# Altium schematic sheet Peripheral.SchDoc
size A4; Organization: Altium Limited; Address1: L3, 12a Rodborough Rd; Address2: Frenchs Forest; Address3: NSW; Address4: Australia 2086
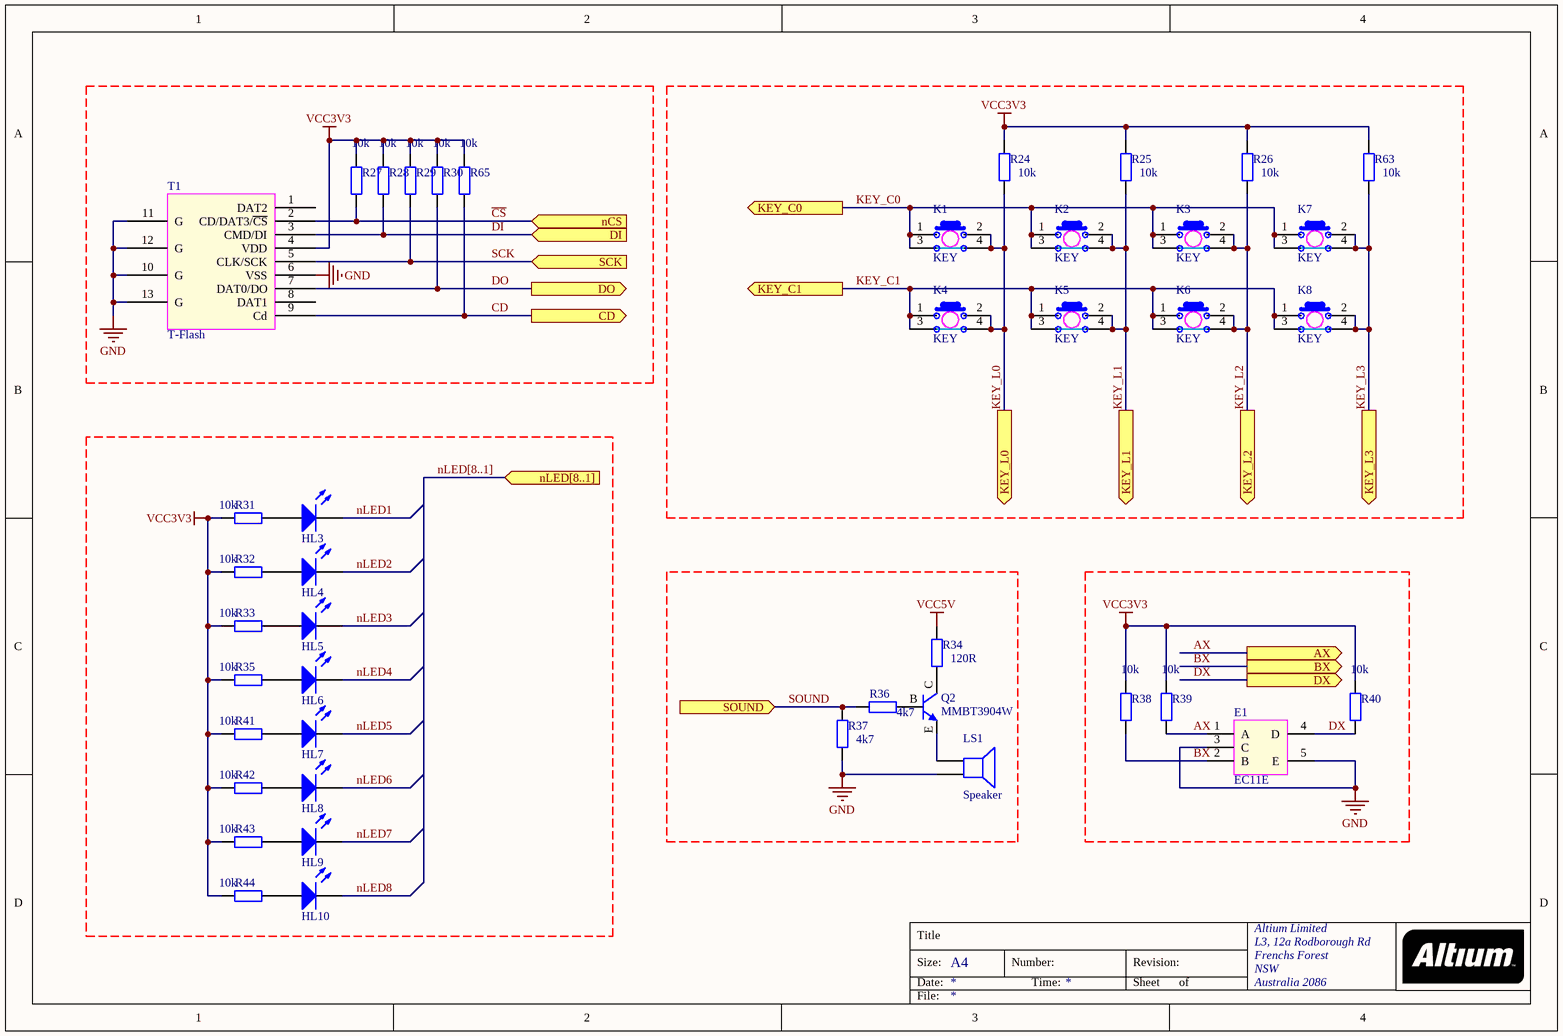
[diagram p0: Peripheral.SchDoc]

## Parts
E1  EC11E  [EC11E]
HL3  LED  [LED_0603]  (value not drawn)
HL4  LED  [LED_0603]  (value not drawn)
HL5  LED  [LED_0603]  (value not drawn)
HL6  LED  [LED_0603]  (value not drawn)
HL7  LED  [LED_0603]  (value not drawn)
HL8  LED  [LED_0603]  (value not drawn)
HL9  LED  [LED_0603]  (value not drawn)
HL10  LED  [LED_0603]  (value not drawn)
K1  KEY
K2  KEY
K3  KEY
K4  KEY
K5  KEY
K6  KEY
K7  KEY  [KEY3]
K8  KEY  [KEY3]
LS1  Speaker  [SPK1]
Q2  MMBT3904W  [SOT_23]
R24  10k  [R0603]
R25  10k  [R0603]
R26  10k  [R0603]
R27  10k  [R0603]
R28  10k  [R0603]
R29  10k  [R0603]
R30  10k  [R0603]
R31  10k  [R0603]
R32  10k  [R0603]
R33  10k  [R0603]
R34  120R  [R0603]
R35  10k  [R0603]
R36  4k7  [R0603]
R37  4k7  [R0603]
R38  10k  [R0603]
R39  10k  [R0603]
R40  10k  [R0603]
R41  10k  [R0603]
R42  10k  [R0603]
R43  10k  [R0603]
R44  10k  [R0603]
R63  10k  [R0603]
R65  10k  [R0603]
T1  T-Flash  [Micro-SD]

## Ports
AX (out), BX (out), CD (out), DI (in), DO (out), DX (out), KEY_C0 (out), KEY_C1 (out), KEY_L0 (out), KEY_L1 (out), KEY_L2 (out), KEY_L3 (out), nCS (in), nLED[8..1] (in), SCK (in), SOUND (in)

## Nets
GND: E1.3(C) E1.5(E) LS1.2 R37.2 T1.6(VSS) T1.10(G) T1.11(G) T1.12(G) T1.13(G)
VCC3V3: R24.2 R25.2 R26.2 R27.2 R28.2 R29.2 R30.2 R31.2 R32.2 R33.2 R35.2 R38.2 R39.2 R40.2 R41.2 R42.2 R43.2 R44.2 R63.2 R65.2 T1.4(VDD)
VCC5V: R34.1
~{CS}: R27.1 T1.2(CD/DAT3/~{CS}) ; port nCS
AX: E1.1(A) R39.1 ; port AX
BX: E1.2(B) R38.1 ; port BX
CD: R65.1 T1.9(Cd) ; port CD
DI: R28.1 T1.3(CMD/DI) ; port DI
DO: R30.1 T1.7(DAT0/DO) ; port DO
DX: E1.4(D) R40.1 ; port DX
KEY_C0: K1.1 K1.3 K2.1 K2.3 K3.1 K3.3 K7.1 K7.3 ; port KEY_C0
KEY_C1: K4.1 K4.3 K5.1 K5.3 K6.1 K6.3 K8.1 K8.3 ; port KEY_C1
KEY_L0: K1.2 K1.4 K4.2 K4.4 R24.1 ; port KEY_L0
KEY_L1: K2.2 K2.4 K5.2 K5.4 R25.1 ; port KEY_L1
KEY_L2: K3.2 K3.4 K6.2 K6.4 R26.1 ; port KEY_L2
KEY_L3: K7.2 K7.4 K8.2 K8.4 R63.1 ; port KEY_L3
nLED1: HL3.K
nLED2: HL4.K
nLED3: HL5.K
nLED4: HL6.K
nLED5: HL7.K
nLED6: HL8.K
nLED7: HL9.K
nLED8: HL10.K
SCK: R29.1 T1.5(CLK/SCK) ; port SCK
SOUND: R36.2 R37.1 ; port SOUND
NetHL3_A: HL3.A R31.1
NetHL4_A: HL4.A R32.1
NetHL5_A: HL5.A R33.1
NetHL6_A: HL6.A R35.1
NetHL7_A: HL7.A R41.1
NetHL8_A: HL8.A R42.1
NetHL9_A: HL9.A R43.1
NetHL10_A: HL10.A R44.1
NetLS1_1: LS1.1 Q2.E
NetQ2_B: Q2.B R36.1
NetQ2_C: Q2.C R34.2

Not connected (* = marked no-connect by the designer): T1 1(DAT2) 8(DAT1)

## Buses and harness runs
bus nLED[8..1] = port nLED[8..1]

## Notes on the sheet
- Title
- Size:
- Date:
- A4
- Number:
- Time:
- Revision:
- Sheet
- of
- File:

## Library data of the parts
E1 = EC11E: encoder
HL3-HL10 = LED 2
LS1 = Speaker: Loudspeaker; Published: 24-Mar-1999; LatestRevisionDate: 17-Jul-2002; LatestRevisionNote: Re-released for DXP Platform.; PackageReference: PIN2; Publisher: Altium Limited
Q2 = MMBT3904TT1G
R24-R33 R35 R38-R44 R63 R65 = RES_04: Value: 10K
R34 R36 R37 = RES_04: Value: 10K
T1 = T-Flash: MICRO SD